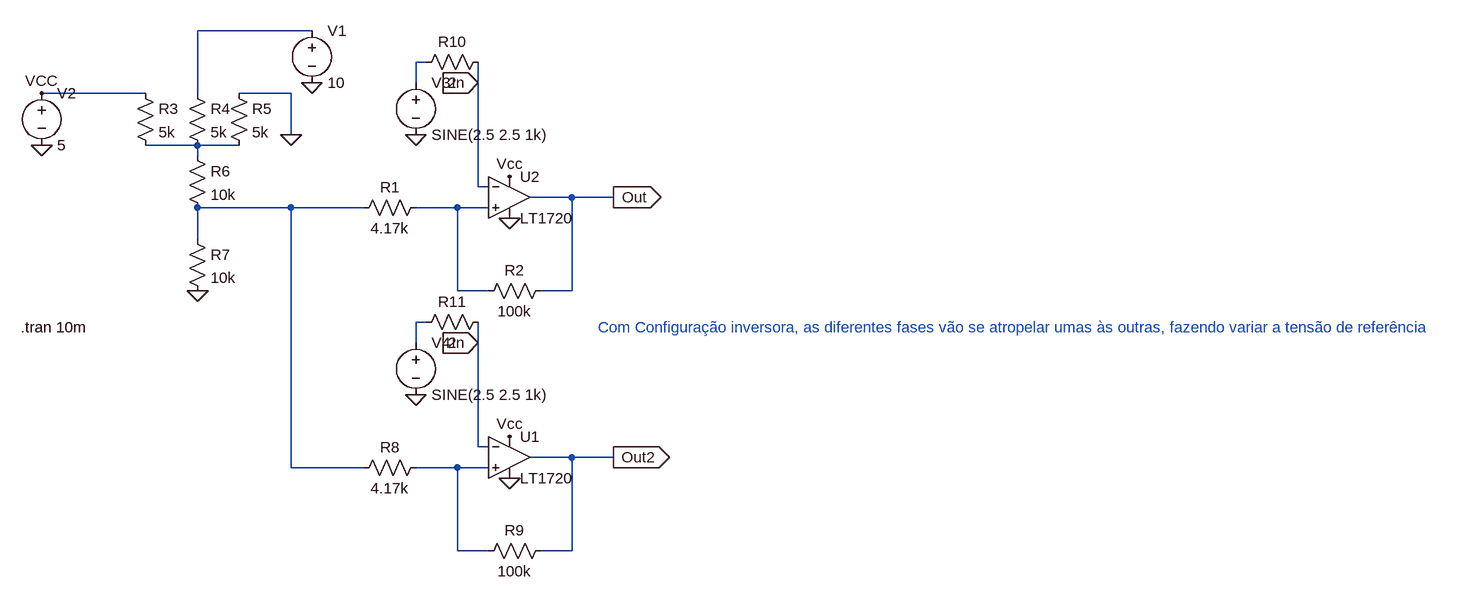
[diagram p0: schematic ConfInv.asc]
ConfInv.asc, the LTspice schematic file:
Version 4
SHEET 1 1800 752
WIRE 208 -96 32 -96
WIRE 384 -48 368 -48
WIRE 368 -16 368 -48
WIRE 464 -16 464 -48
WIRE -48 0 -208 0
WIRE 32 0 32 -96
WIRE 176 0 96 0
WIRE 176 64 176 0
WIRE 32 80 -48 80
WIRE 96 80 32 80
WIRE 32 96 32 80
WIRE 464 144 464 -16
WIRE 480 144 464 144
WIRE 608 160 544 160
WIRE 672 160 608 160
WIRE 176 176 32 176
WIRE 288 176 176 176
WIRE 432 176 368 176
WIRE 480 176 432 176
WIRE 32 224 32 176
WIRE 432 304 432 176
WIRE 480 304 432 304
WIRE 608 304 608 160
WIRE 608 304 560 304
WIRE 384 352 368 352
WIRE 368 384 368 352
WIRE 464 384 464 352
WIRE 464 544 464 384
WIRE 480 544 464 544
WIRE 608 560 544 560
WIRE 672 560 608 560
WIRE 176 576 176 176
WIRE 288 576 176 576
WIRE 432 576 368 576
WIRE 480 576 432 576
WIRE 432 704 432 576
WIRE 480 704 432 704
WIRE 608 704 608 560
WIRE 608 704 560 704
FLAG -208 80 0
FLAG -208 0 VCC
FLAG 512 128 Vcc
FLAG 512 192 0
FLAG 368 64 0
FLAG 672 160 Out
IOPIN 672 160 Out
FLAG 464 -16 In
IOPIN 464 -16 In
FLAG 32 304 0
FLAG 208 -16 0
FLAG 176 64 0
FLAG 512 528 Vcc
FLAG 512 592 0
FLAG 368 464 0
FLAG 672 560 Out2
IOPIN 672 560 Out
FLAG 464 384 In
IOPIN 464 384 In
SYMBOL voltage -208 -16 R0
WINDOW 123 0 0 Left 2
WINDOW 39 0 0 Left 2
SYMATTR InstName V2
SYMATTR Value 5
SYMBOL res 384 160 R90
WINDOW 0 0 56 VBottom 2
WINDOW 3 32 56 VTop 2
SYMATTR InstName R1
SYMATTR Value 4.17k
SYMBOL Comparators\\LT1720 512 96 R0
SYMATTR InstName U2
SYMBOL res 576 288 R90
WINDOW 0 0 56 VBottom 2
WINDOW 3 32 56 VTop 2
SYMATTR InstName R2
SYMATTR Value 100k
SYMBOL voltage 368 -32 R0
WINDOW 123 0 0 Left 2
WINDOW 39 0 0 Left 2
SYMATTR InstName V3
SYMATTR Value SINE(2.5 2.5 1k)
SYMBOL res -64 -16 R0
SYMATTR InstName R3
SYMATTR Value 5k
SYMBOL res 16 -16 R0
SYMATTR InstName R4
SYMATTR Value 5k
SYMBOL res 80 -16 R0
SYMATTR InstName R5
SYMATTR Value 5k
SYMBOL res 16 80 R0
SYMATTR InstName R6
SYMATTR Value 10k
SYMBOL res 16 208 R0
SYMATTR InstName R7
SYMATTR Value 10k
SYMBOL voltage 208 -112 R0
WINDOW 123 0 0 Left 2
WINDOW 39 0 0 Left 2
SYMATTR InstName V1
SYMATTR Value 10
SYMBOL res 384 560 R90
WINDOW 0 0 56 VBottom 2
WINDOW 3 32 56 VTop 2
SYMATTR InstName R8
SYMATTR Value 4.17k
SYMBOL Comparators\\LT1720 512 496 R0
SYMATTR InstName U1
SYMBOL res 576 688 R90
WINDOW 0 0 56 VBottom 2
WINDOW 3 32 56 VTop 2
SYMATTR InstName R9
SYMATTR Value 100k
SYMBOL voltage 368 368 R0
WINDOW 123 0 0 Left 2
WINDOW 39 0 0 Left 2
SYMATTR InstName V4
SYMATTR Value SINE(2.5 2.5 1k)
SYMBOL res 480 -64 R90
WINDOW 0 0 56 VBottom 2
WINDOW 3 32 56 VTop 2
SYMATTR InstName R10
SYMATTR Value 2
SYMBOL res 480 336 R90
WINDOW 0 0 56 VBottom 2
WINDOW 3 32 56 VTop 2
SYMATTR InstName R11
SYMATTR Value 2
TEXT -240 360 Left 2 !.tran 10m
TEXT 648 360 Left 2 ;Com Configuração inversora, as diferentes fases vão se atropelar umas às outras, fazendo variar a tensão de referência

The netlist it stands for:
* ConfInv.asc
V2 VCC 0 5
R1 N005 N004 4.17k
XU2 N005 In VCC 0 Out LT1720  ; pins In+ In- V+ V- OUT
R2 Out N005 100k
V3 N002 0 SINE(2.5 2.5 1k)
R3 VCC N003 5k
R4 N001 N003 5k
R5 0 N003 5k
R6 N003 N004 10k
R7 N004 0 10k
V1 N001 0 10
R8 N007 N004 4.17k
XU1 N007 In VCC 0 Out2 LT1720  ; pins In+ In- V+ V- OUT
R9 Out2 N007 100k
V4 N006 0 SINE(2.5 2.5 1k)
R10 In N002 2
R11 In N006 2
.tran 10m
* Com Configuração inversora, as diferentes fases vão se atropelar umas às outras, fazendo variar a tensão de referência
.lib LT1720.sub
.backanno
.end